# Altium schematic sheet Voltage reference.SchDoc
size A; SheetNumber: 6; SheetTotal: 6
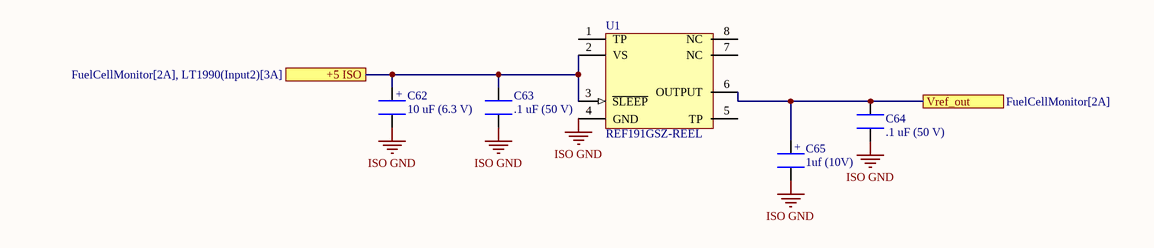
[diagram p0: Voltage reference.SchDoc]

## Parts
C62  10 uF (6.3 V)  [10 uF cap]
C63  .1 uF (50 V)  [.1uF capacitor]
C64  .1 uF (50 V)  [.1uF capacitor]
C65  1uf (10V)  [1 uF cap]
U1  REF191GSZ-REEL  [ADI-R-8_N]

## Ports
+5 ISO (see FuelCellMonitor[2A], LT1990(Input2)[3A]), Vref_out (see FuelCellMonitor[2A])

## Nets
ISO GND: C62.2 C63.2 C64.1 C65.2 U1.4(GND)
+5 ISO: C62.1 C63.1 U1.2(VS) U1.3(~{SLEEP}) ; port +5 ISO
Vref_out: C64.2 C65.1 U1.6(OUTPUT) ; port Vref_out

Not connected (* = marked no-connect by the designer): U1 1(TP) 5(TP) 7(NC) 8(NC)

## Notes on the sheet
- (in symbol 1uf cap) +
- (in symbol 10 uF cap) +

## Library data of the parts
C62 = 10 uF cap
C63 C64 = .1 uF cap
C65 = 1uf cap
U1 = REF191GSZ-REEL: Precision Micropower, Low Dropout Voltage Reference, 2.048 V Output, 2.3 to 15 V Supply, Industrial, 8-pin SOIC (R-8), Reel; Manufacturer: Analog Devices; Vout: 2.048V; Ref Out TC (ppm/C): 10; Mounting Technology: Surface Mount; ComponentLink3URL: http://www.analog.com/static/imported-files/packages/PKG_PDF/SOIC_Narrow%20(R)/R_8.pdf; PackageDescription: 8-Pin Standard Small Outline Package, Body 4.9 x 3.9 mm, Pitch 1.27 mm; PackageVersion: 060506-A, 06/2006; ComponentLink1Description: Manufacturer URL; Code_JEDEC: MS-012-AA; ComponentLink2URL: http://www.analog.com/static/imported-files/data_sheets/REF19xSeries.pdf; Operating Temp Range: -40 to 85 degC; PartNumber: REF191GSZ-REEL; Packing: Reel; ComponentLink3Description: Package Specification; ComponentLink4Description: URL Link1; PackageReference: R-8; ComponentLink1URL: http://www.analog.com/en/index.html; ComponentLink4URL: Product URL:http://www.analog.com/en/special-linear-functions/voltage-references/ref191/products/product.html; DatasheetVersion: Rev. L; ComponentLink2Description: Datasheet